# Altium schematic sheet OutputModule.SchDoc
size A4
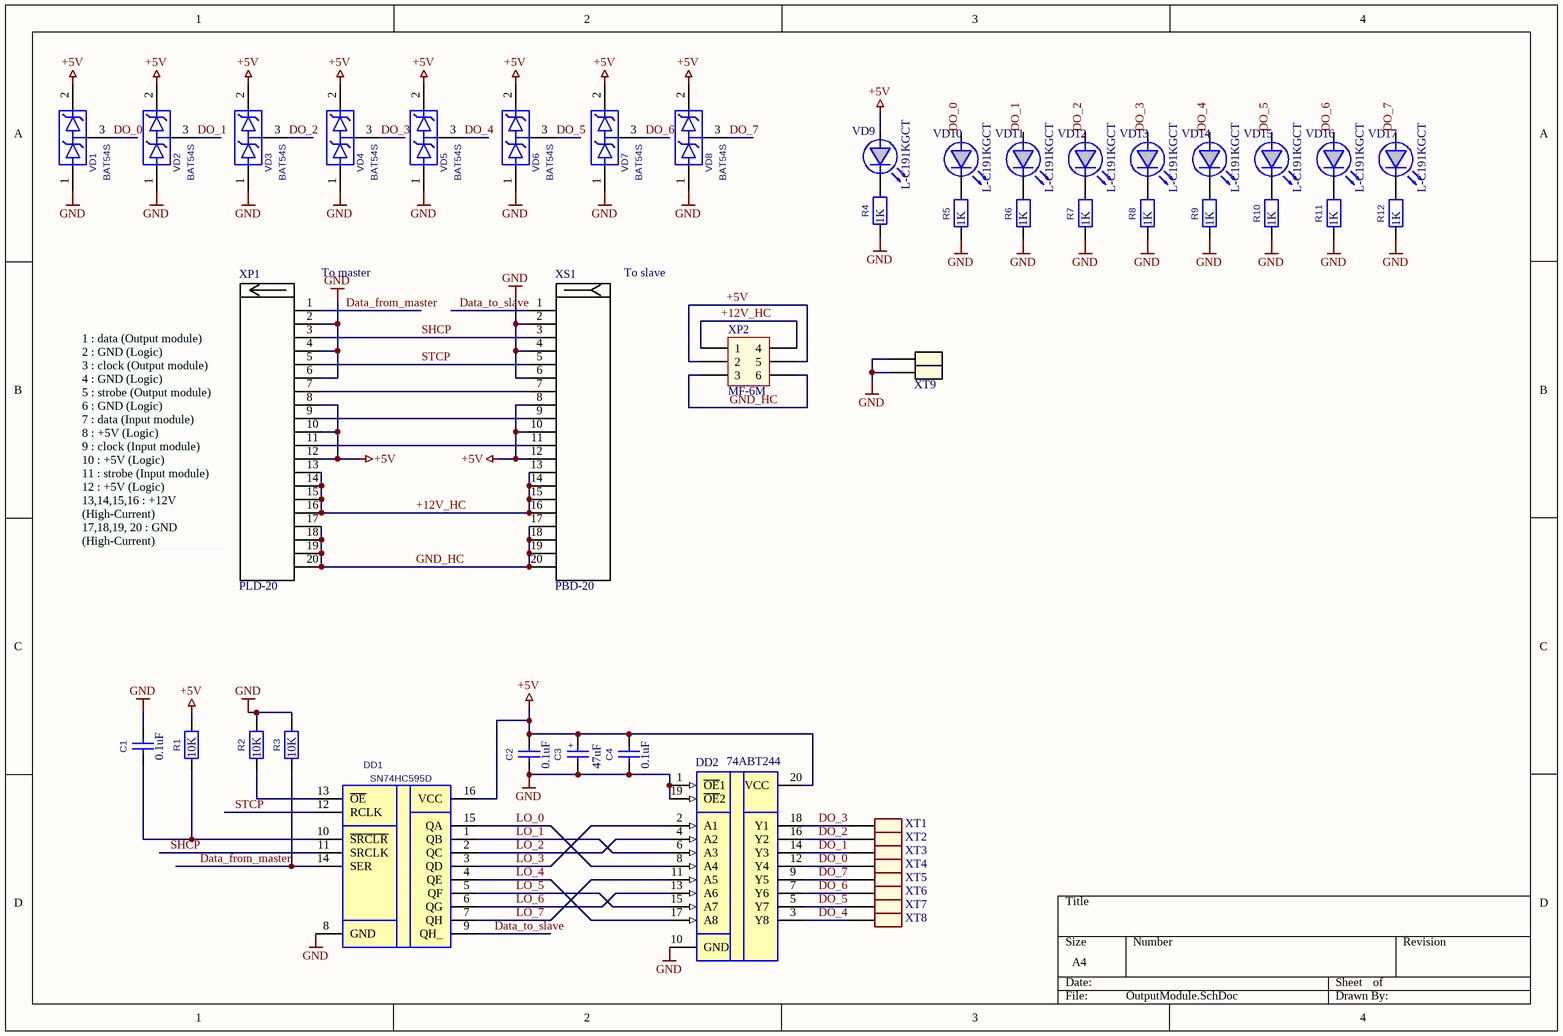
[diagram p0: OutputModule.SchDoc]

## Parts
C1  0.1uF  [C-1608[0603]]
C2  0.1uF  [C-1608[0603]]
C3  47uF  [C-CASE]
C4  0.1uF  [C-1608[0603]]
DD1  SN74HC595D  [SO-G16]
DD2  74ABT244  [TSSOP20]
R1  10K  [R-1608[0603]]
R2  10K  [R-1608[0603]]
R3  10K  [R-1608[0603]]
R4  1K  [R-1608[0603]]
R5  1K  [R-1608[0603]]
R6  1K  [R-1608[0603]]
R7  1K  [R-1608[0603]]
R8  1K  [R-1608[0603]]
R9  1K  [R-1608[0603]]
R10  1K  [R-1608[0603]]
R11  1K  [R-1608[0603]]
R12  1K  [R-1608[0603]]
VD1  BAT54S  [SOT-23]
VD2  BAT54S  [SOT-23]
VD3  BAT54S  [SOT-23]
VD4  BAT54S  [SOT-23]
VD5  BAT54S  [SOT-23]
VD6  BAT54S  [SOT-23]
VD7  BAT54S  [SOT-23]
VD8  BAT54S  [SOT-23]
VD9  L-C191KGCT  [LED-0603]
VD10  L-C191KGCT  [LED-0603]
VD11  L-C191KGCT  [LED-0603]
VD12  L-C191KGCT  [LED-0603]
VD13  L-C191KGCT  [LED-0603]
VD14  L-C191KGCT  [LED-0603]
VD15  L-C191KGCT  [LED-0603]
VD16  L-C191KGCT  [LED-0603]
VD17  L-C191KGCT  [LED-0603]
XP1  PLD-20  [PLD-20 ROT]
XP2  MF-6M  [MF-6M]
XS1  PBD-20  [PBD-20 Rot]
XT1  DG141V-01P  [DG141V-01P (XY123R)]  (value not drawn)
XT2  DG141V-01P  [DG141V-01P (XY123R)]  (value not drawn)
XT3  DG141V-01P  [DG141V-01P (XY123R)]  (value not drawn)
XT4  DG141V-01P  [DG141V-01P (XY123R)]  (value not drawn)
XT5  DG141V-01P  [DG141V-01P (XY123R)]  (value not drawn)
XT6  DG141V-01P  [DG141V-01P (XY123R)]  (value not drawn)
XT7  DG141V-01P  [DG141V-01P (XY123R)]  (value not drawn)
XT8  DG141V-01P  [DG141V-01P (XY123R)]  (value not drawn)
XT9  1-1776244-0 (TYCO)  [1-1776244-0]  (value not drawn)

## Nets
+5V: C2.1 C3.1(+) C4.1 DD1.16(VCC) DD2.20(VCC) R1.2 VD1.2(c) VD2.2(c) VD3.2(c) VD4.2(c) VD5.2(c) VD6.2(c) VD7.2(c) VD8.2(c) VD9.2(A) XP1.8 XP1.10 XP1.12 XP2.2 XP2.5 XS1.8 XS1.10 XS1.12
GND: C1.1 C2.2 C3.2(-) C4.2 DD1.8(GND) DD2.1(~{OE}1) DD2.10(GND) DD2.19(~{OE}2) R2.2 R3.2 R4.1 R5.1 R6.1 R7.1 R8.1 R9.1 R10.1 R11.1 R12.1 VD1.1(a) VD2.1(a) VD3.1(a) VD4.1(a) VD5.1(a) VD6.1(a) VD7.1(a) VD8.1(a) XP1.2 XP1.4 XP1.6 XS1.2 XS1.4 XS1.6 XT9.1 XT9.2
+12V_HC: XP1.13 XP1.14 XP1.15 XP1.16 XP2.1 XP2.4 XS1.13 XS1.14 XS1.15 XS1.16
Data_from_master: DD1.14(SER) R3.1 XP1.1
Data_to_slave: DD1.9(QH_) XS1.1
DO_0: DD2.12(Y4) VD1.3(ka) VD10.2(A) XT4.1
DO_1: DD2.14(Y3) VD2.3(ka) VD11.2(A) XT3.1
DO_2: DD2.16(Y2) VD3.3(ka) VD12.2(A) XT2.1
DO_3: DD2.18(Y1) VD4.3(ka) VD13.2(A) XT1.1
DO_4: DD2.3(Y8) VD5.3(ka) VD14.2(A) XT8.1
DO_5: DD2.5(Y7) VD6.3(ka) VD15.2(A) XT7.1
DO_6: DD2.7(Y6) VD7.3(ka) VD16.2(A) XT6.1
DO_7: DD2.9(Y5) VD8.3(ka) VD17.2(A) XT5.1
GND_HC: XP1.17 XP1.18 XP1.19 XP1.20 XP2.3 XP2.6 XS1.17 XS1.18 XS1.19 XS1.20
LO_0: DD1.15(QA) DD2.8(A4)
LO_1: DD1.1(QB) DD2.6(A3)
LO_2: DD1.2(QC) DD2.4(A2)
LO_3: DD1.3(QD) DD2.2(A1)
LO_4: DD1.4(QE) DD2.17(A8)
LO_5: DD1.5(QF) DD2.15(A7)
LO_6: DD1.6(QG) DD2.13(A6)
LO_7: DD1.7(QH) DD2.11(A5)
SHCP: DD1.11(SRCLK) XP1.3 XS1.3
STCP: DD1.12(RCLK) XP1.5 XS1.5
NetC1_2: C1.2 DD1.10(~{SRCLR}) R1.1
NetDD1_13: DD1.13(~{OE}) R2.1
NetR4_2: R4.2 VD9.1(K)
NetR5_2: R5.2 VD10.1(K)
NetR6_2: R6.2 VD11.1(K)
NetR7_2: R7.2 VD12.1(K)
NetR8_2: R8.2 VD13.1(K)
NetR9_2: R9.2 VD14.1(K)
NetR10_2: R10.2 VD15.1(K)
NetR11_2: R11.2 VD16.1(K)
NetR12_2: R12.2 VD17.1(K)
NetXP1_7: XP1.7 XS1.7
NetXP1_9: XP1.9 XS1.9
NetXP1_11: XP1.11 XS1.11

## Notes on the sheet
- (near XP1) To master
- (near XS1) To slave
- 1 : data (Output module)
  2 : GND (Logic)
  3 : clock (Output module)
  4 : GND (Logic)
  5 : strobe (Output module)
  6 : GND (Logic)
  7 : data (Input module)
  8 : +5V (Logic)
  9 : clock (Input module)
  10 : +5V (Logic)
  11 : strobe (Input module)
  12 : +5V (Logic)
  13,14,15,16 : +12V (High-Current)
  17,18,19, 20 : GND (High-Current)

## Library data of the parts
C1 C2 C4 = C-0603: Value: 0.1uF
C3 = C-CCASE: Value: 47uF
DD2 = SN74LVC244APW: Octal Buffer/Driver with 3-State Outputs; Value: *
R1-R12 = R-0603
  R1-R3: Value: 10K
  R4-R12: Value: 1K
VD1-VD8 = BAT54S: Schottky barrier (double) diodes
VD9-VD17 = L-C191KGCT: 0603 Green Led
XP1 = PLD-20: 20 pin, 2 row, MALE connector
XP2 = MF-6M: Molex Male connector
XS1 = PBD-20: 2.54mm, 20 pin FEMALE connector
XT1-XT8 = DG141V-01P: Клеммник нажимной 2.54мм
XT9 = 1-1776244-0 (TYCO): Винтовой клеммник 5.0мм
DD1 = SN74HC595D: Value: *